# EAGLE design pla_xc9536 (EAGLE 7.5.0)
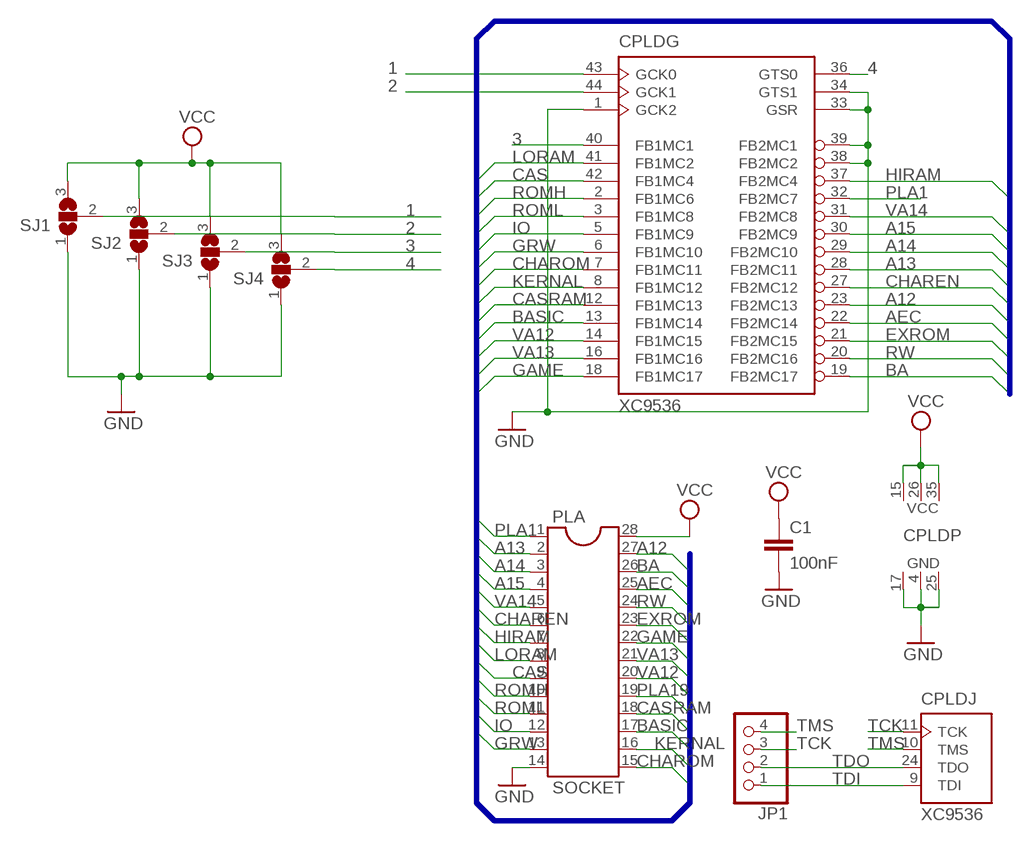
[diagram p0: schematic, sheet 1]

## Parts
C1  100nF  C-EUC1206K  [C1206K]
CPLD  XC9536  XC9536-44VQ44  [VQ44]
JP1  PINHD-1X4  [1X04]
PLA  SOCKET  DIL28  [DIL28-6-ROUND]
SJ1  SJ2W  [SJ_2]
SJ2  SJ2W  [SJ_2]
SJ3  SJ2W  [SJ_2]
SJ4  SJ2W  [SJ_2]

## Nets
1: CPLD.43(G:GCK0) SJ1.2
2: CPLD.44(G:GCK1) SJ2.2
3: CPLD.40(G:FB1MC1) SJ3.2
4: CPLD.36(G:GTS0) SJ4.2
A12: CPLD.23(G:FB2MC13) PLA.27
A13: CPLD.28(G:FB2MC11) PLA.2
A14: CPLD.29(G:FB2MC10) PLA.3
A15: CPLD.30(G:FB2MC9) PLA.4
AEC: CPLD.22(G:FB2MC14) PLA.25
BA: CPLD.19(G:FB2MC17) PLA.26
BASIC: CPLD.13(G:FB1MC14) PLA.17
CAS: CPLD.42(G:FB1MC4) PLA.9
CASRAM: CPLD.12(G:FB1MC13) PLA.18
CHAREN: CPLD.27(G:FB2MC12) PLA.6
CHAROM: CPLD.7(G:FB1MC11) PLA.15
EXROM: CPLD.21(G:FB2MC15) PLA.23
GAME: CPLD.18(G:FB1MC17) PLA.22
GND: C1.2 CPLD.1(G:GCK2) CPLD.4(P:GND) CPLD.17(P:GND) CPLD.25(P:GND) CPLD.33(G:GSR) CPLD.34(G:GTS1) CPLD.38(G:FB2MC2) CPLD.39(G:FB2MC1) PLA.14 SJ1.1 SJ2.1 SJ3.1 SJ4.1
GRW: CPLD.6(G:FB1MC10) PLA.13
HIRAM: CPLD.37(G:FB2MC4) PLA.7
IO: CPLD.5(G:FB1MC9) PLA.12
KERNAL: CPLD.8(G:FB1MC12) PLA.16
LORAM: CPLD.41(G:FB1MC2) PLA.8
PLA1: CPLD.32(G:FB2MC7) PLA.1
PLA19: PLA.19
ROMH: CPLD.2(G:FB1MC6) PLA.10
ROML: CPLD.3(G:FB1MC8) PLA.11
RW: CPLD.20(G:FB2MC16) PLA.24
TCK: CPLD.11(J:TCK) JP1.3
TDI: CPLD.9(J:TDI) JP1.1
TDO: CPLD.24(J:TDO) JP1.2
TMS: CPLD.10(J:TMS) JP1.4
VA12: CPLD.14(G:FB1MC15) PLA.20
VA13: CPLD.16(G:FB1MC16) PLA.21
VA14: CPLD.31(G:FB2MC8) PLA.5
VCC: C1.1 CPLD.15(P:VCC) CPLD.26(P:VCC) CPLD.35(P:VCC) PLA.28 SJ1.3 SJ2.3 SJ3.3 SJ4.3

## Buses
PLA[1..28]

## Library data of the parts
C1 = rcl:C-EU: CAPACITOR, European symbol
CPLD = XILINX:XC9536-44
JP1 = pinhead:PINHD-1X4: PIN HEADER
PLA = ic-package:DIL28: Dual In Line
SJ1-SJ4 = jumper:SJ2W: SMD solder JUMPER

## Board
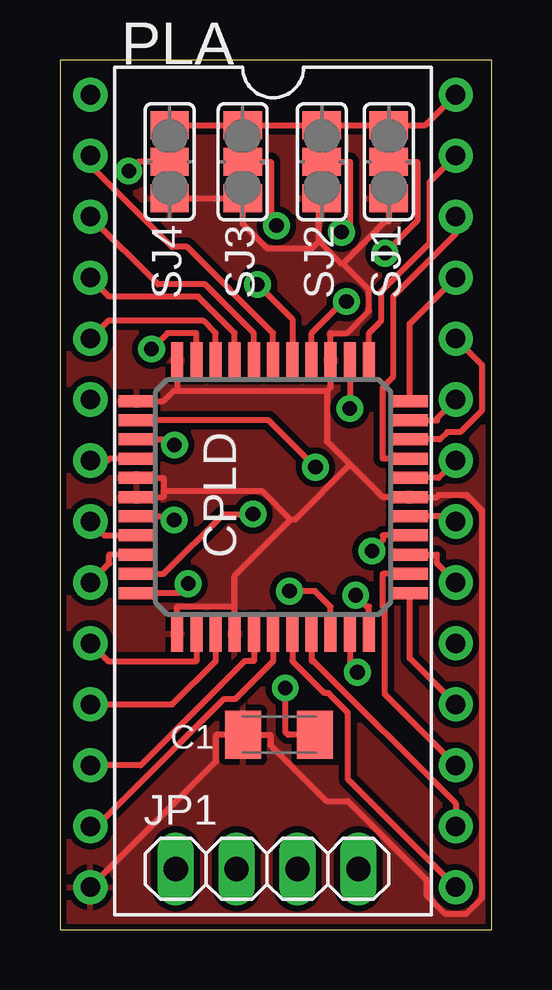
[diagram p1: board, top side]
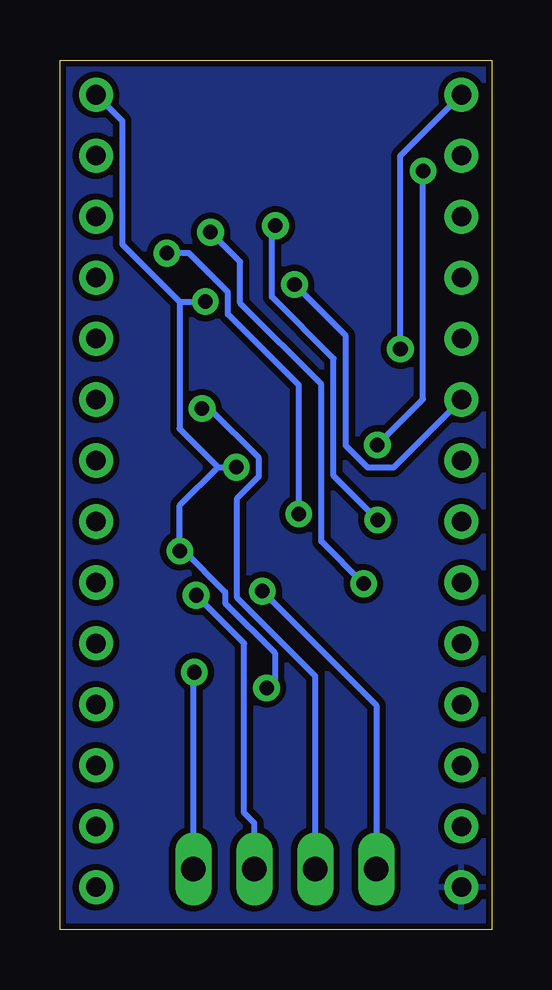
[diagram p2: board, bottom side, seen from below]

Size 18.01 x 36.25 mm. Coordinates in mm from the lower left corner, seen from the top.
Outline: 0,0 18.01,0 18.01,36.25 0,36.25 0,0
Copper layers (1*16): Top 0.035mm / dielectric 1.5mm / Bottom 0.035mm
Design rules "steve": minimum track width 10mil, minimum drill 24mil, track to track 10mil, track to pad 10mil, pad to pad 10mil, via to via 10mil, smd to smd 10mil, copper to edge 10mil, drill to drill 10mil, minimum pad ring 10mil, minimum via ring 10mil, stop-mask expansion 4mil, vias tented up to drill 0mil, thermal gap 10mil

### Footprints (pad centres in the part's own frame; a part is rotated, then mirrored left to right if it is on the bottom)
C1206K = smd 1.5 x 2: 1 -1.5,0; 2 1.5,0
VQ44 = smd 1.5 x 0.5: 1 -5.7,4; 2 -5.7,3.2; 3 -5.7,2.4; 4 -5.7,1.6; 5 -5.7,0.8; 6 -5.7,0; 7 -5.7,-0.8; 8 -5.7,-1.6; 9 -5.7,-2.4; 10 -5.7,-3.2; 11 -5.7,-4; 23 5.7,-4; 24 5.7,-3.2; 25 5.7,-2.4; 26 5.7,-1.6; 27 5.7,-0.8; 28 5.7,0; 29 5.7,0.8; 30 5.7,1.6; 31 5.7,2.4; 32 5.7,3.2; 33 5.7,4 | smd 0.5 x 1.5: 12 -4,-5.7; 13 -3.2,-5.7; 14 -2.4,-5.7; 15 -1.6,-5.7; 16 -0.8,-5.7; 17 0,-5.7; 18 0.8,-5.7; 19 1.6,-5.7; 20 2.4,-5.7; 21 3.2,-5.7; 22 4,-5.7; 34 4,5.7; 35 3.2,5.7; 36 2.4,5.7; 37 1.6,5.7; 38 0.8,5.7; 39 0,5.7; 40 -0.8,5.7; 41 -1.6,5.7; 42 -2.4,5.7; 43 -3.2,5.7; 44 -4,5.7
1X04 = drill 1.016 long: 1 -3.81,0; 2 -1.27,0; 3 1.27,0; 4 3.81,0
DIL28-6-ROUND = drill 0.813 pad 1.422: 1 -15.24,-7.62; 2 -12.7,-7.62; 3 -10.16,-7.62; 4 -7.62,-7.62; 5 -5.08,-7.62; 6 -2.54,-7.62; 7 0,-7.62; 8 2.54,-7.62; 9 5.08,-7.62; 10 7.62,-7.62; 11 10.16,-7.62; 12 12.7,-7.62; 13 15.24,-7.62; 14 17.78,-7.62; 15 17.78,7.62; 16 15.24,7.62; 17 12.7,7.62; 18 10.16,7.62; 19 7.62,7.62; 20 5.08,7.62; 21 2.54,7.62; 22 0,7.62; 23 -2.54,7.62; 24 -5.08,7.62; 25 -7.62,7.62; 26 -10.16,7.62; 27 -12.7,7.62; 28 -15.24,7.62
SJ_2 = smd 1.168 x 1.6: 1 -1.524,0; 2 0,0; 3 1.524,0

### Placement (x,y rotation side)
C1  9.14,8.13 180 top
CPLD  8.89,18.03 90 top
JP1  8.64,2.54 0 top
PLA  8.89,19.56 270 top
SJ1  13.72,32 90 top
SJ2  10.92,32 90 top
SJ3  7.62,32 90 top
SJ4  4.57,32 90 top

### Tracks (layer width: path | path; a pad name or v marks a point on that pad's centre or on a via)
1  (via drill 0.61 pad 1.12)
  Top 0.254: v8.05,17.33 6.82,17.33 4.32,14.83 CPLD.43 | v13.56,28.2 14.9,29.54 14.9,32 SJ1.2
  Bottom 0.254: v8.05,17.33 8.05,22.7 11.01,25.65 11.01,26.57 12.64,28.2 v13.56,28.2
2  (via drill 0.61 pad 1.12)
  Top 0.254: v11.74,29.07 12.1,29.44 12.1,32 SJ2.2 | v5.35,14.43 4.96,14.03 CPLD.44
  Bottom 0.254: v5.35,14.43 7.11,16.19 7.11,22.73 10.5,26.12 10.5,27.84 v11.74,29.07
3  (via drill 0.61 pad 1.12)
  Top 0.254: SJ3.2 8.8,32 8.8,29.58 v9.03,29.35 | v4.76,17.08 4.48,17.08 4.32,17.23 CPLD.40
  Bottom 0.254: v4.76,17.08 6.61,18.92 6.61,23.81 9.18,26.38 9.18,29.2 v9.03,29.35
4  (via drill 0.61 pad 1.12)
  Top 0.254: SJ4.2 3.25,32 v2.87,31.62 | CPLD.36 4.55,20.43 v4.78,20.21
  Bottom 0.254: v4.78,20.21 2.87,22.12 v2.87,31.62
A12
  Top 0.254: PLA.27 15.42,31.17 15.42,28.63 13.4,26.61 13.4,25.37 12.89,24.86 CPLD.23
A13
  Top 0.254: PLA.2 1.27,31.85 4.67,28.46 5.3,28.46 8.89,24.86 CPLD.28
A14
  Top 0.254: PLA.3 4.09,26.9 6.06,26.9 8.09,24.86 CPLD.29
A15
  Top 0.254: PLA.4 2.06,26.39 5.77,26.39 7.29,24.86 CPLD.30
AEC
  Top 0.254: CPLD.22 14.59,25.26 PLA.25
BA
  Top 0.254: PLA.26 16.51,29 13.91,26.4 13.91,23.05 13.46,22.6 13.46,19.63 CPLD.19
BASIC
  Top 0.254: CPLD.13 13.46,14.83 13.46,13.46 13.55,13.38 13.55,9.82 PLA.17
CAS
  Top 0.254: CPLD.42 2.06,15.63 2.06,15.27 PLA.9
CASRAM
  Top 0.254: PLA.18 14.59,11.32 CPLD.12
CHAREN  (via drill 0.61 pad 1.12)
  Top 0.254: v8.23,26.89 9.69,25.44 CPLD.27
  Bottom 0.254: PLA.6 4.1,19.27 5.17,19.27 6.09,20.18 6.09,24.75 v8.23,26.89
CHAROM
  Top 0.254: PLA.15 12.01,6.28 12.01,9.05 11.2,9.86 11.03,9.86 9.69,11.2 CPLD.7
EXROM
  Top 0.254: CPLD.21 15.72,21.23 15.72,21.31 PLA.23
GAME
  Top 0.254: PLA.22 15.79,18.83 CPLD.18
GND
  Top 0.254: 10.79,28.69 10.51,28.4 8.64,28.4 7.62,29.42 SJ3.1 SJ4.1 | 10.79,28.69 10.79,30.35 SJ2.1 | 11.79,27.76 11.72,27.76 10.79,28.69 | 4.32,18.27 4.32,18.03 CPLD.39 | 4.32,18.27 4.32,18.83 CPLD.38 | 9.62,17.09 8.44,18.27 4.32,18.27 | 11.79,27.76 12.89,26.67 12.89,25.79 11.96,24.86 11.29,24.86 CPLD.25 11.29,22.6 11.13,22.45 | 11.13,22.45 11.13,20.36 12.1,19.39 | 11.13,22.45 4.89,22.45 | 4.89,22.45 4.73,22.45 4.32,22.03 CPLD.34 | 11.79,27.76 13.54,29.52 13.72,29.52 SJ1.1 | 12.1,19.39 13.46,18.03 CPLD.17 15.72,18.03 15.8,18.11 16.97,18.11 17.61,17.48 17.61,1.33 16.96,0.68 16.06,0.68 15.28,1.47 15.28,2.09 12.01,5.36 11.12,5.36 8.78,7.7 8.78,8.13 C1.2 6.51,8.13 6.51,7.02 PLA.14 | 12.1,19.39 9.79,17.09 9.62,17.09 | 7.29,13.46 7.29,14.76 9.62,17.09 | 4.89,22.45 4.89,22.6 CPLD.33 | CPLD.1 4.89,13.46 7.29,13.46 | 7.29,13.46 7.29,13.34 CPLD.4
  pour Top: 0,0 0,36.32 18.03,36.07 18.03,0
  pour Bottom: 0,0 0,36.32 18.03,36.07 18.03,0
GRW
  Top 0.254: CPLD.6 8.89,11.2 7.31,9.63 6.85,9.63 1.54,4.32 PLA.13
HIRAM
  Top 0.254: CPLD.37 2.06,19.63 1.98,19.56 PLA.7
IO
  Top 0.254: PLA.12 3.35,6.86 7.7,11.2 8.09,11.2 CPLD.5
KERNAL
  Top 0.254: PLA.16 16.51,5.27 10.58,11.2 10.49,11.2 CPLD.8
LORAM
  Top 0.254: PLA.8 1.85,16.43 CPLD.41
PLA1  (via drill 0.61 pad 1.12)
  Top 0.254: v3.82,24.2 4.48,24.86 5.69,24.86 CPLD.32
  Bottom 0.254: v3.82,24.2 | v3.82,24.2 3.82,32.25 PLA.1
ROMH
  Top 0.254: CPLD.2 5.69,11.2 2,11.2 PLA.10
ROML
  Top 0.254: CPLD.3 6.49,11.2 4.68,9.4 PLA.11
RW
  Top 0.254: PLA.24 17.6,23.55 17.6,21.64 16.7,20.74 16.15,20.74 15.84,20.43 CPLD.20
TCK  (via drill 0.61 pad 1.12)
  Top 0.254: CPLD.11 12.89,13.46 12.81,13.46 v12.33,13.94
  Bottom 0.254: JP1.3 9.91,4.45 10.33,4.87 10.33,11.94 v12.33,13.94
TDI  (via drill 0.61 pad 1.12)
  Top 0.254: v9.57,14.11 10.64,14.11 11.29,13.46 CPLD.9
  Bottom 0.254: v9.57,14.11 4.83,9.37 JP1.1
TDO  (via drill 0.61 pad 1.12)
  Top 0.254: CPLD.24 v12.09,21.72
  Bottom 0.254: v12.09,21.72 11.77,21.72 9.72,19.67 9.72,18.89 10.62,17.99 10.62,13.83 7.37,10.58 7.37,4.45 JP1.2
TMS  (via drill 0.61 pad 1.12)
  Top 0.254: CPLD.10 12.09,11.05 v12.41,10.73
  Bottom 0.254: v12.41,10.73 12.45,10.7 12.45,4.45 JP1.4
VA12
  Top 0.254: CPLD.14 15.72,15.63 15.72,15.27 PLA.20
VA13
  Top 0.254: PLA.21 16.29,17.23 CPLD.16
VA14
  Top 0.254: PLA.5 2,25.37 5.98,25.37 6.49,24.86 CPLD.31
VCC  (via drill 0.61 pad 1.12)
  Top 0.254: CPLD.26 10.49,24.86 11.81,26.18 v11.95,26.18 | v10.66,19.28 8.71,21.23 CPLD.35 | SJ4.3 SJ3.3 SJ2.3 SJ1.3 15.24,33.53 PLA.28 | C1.1 9.51,8.13 9.39,8.25 v9.39,10.08 | CPLD.15 13.46,16.43 13.46,16.23 v13.02,15.79
  Bottom 0.254: 13.03,26.18 v11.95,26.18 | PLA.28 15.42,33.71 15.42,28.57 13.03,26.18 | 13.03,26.18 13.03,20.89 11.43,19.28 | 11.43,19.28 v10.66,19.28 | 11.43,19.28 13.02,17.69 v13.02,15.79 12.85,15.79 11.13,14.07 11.13,13.62 9.05,11.55 9.05,10.42 v9.39,10.08